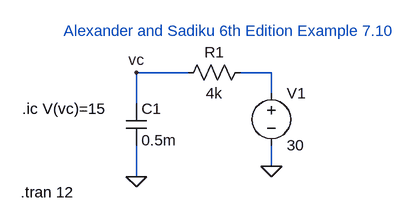
[diagram p0: schematic sadiku_chapter7_example_710_with_Source.asc]
sadiku_chapter7_example_710_with_Source.asc, the LTspice schematic file:
Version 4
SHEET 1 880 680
WIRE 96 80 16 80
WIRE 224 80 176 80
WIRE 224 112 224 80
WIRE 16 128 16 80
WIRE 224 224 224 192
WIRE 16 240 16 192
FLAG 16 240 0
FLAG 224 224 0
FLAG 16 80 vc
SYMBOL cap 0 128 R0
SYMATTR InstName C1
SYMATTR Value 0.5m
SYMBOL res 192 64 R90
WINDOW 0 0 56 VBottom 2
WINDOW 3 32 56 VTop 2
SYMATTR InstName R1
SYMATTR Value 4k
SYMBOL voltage 224 96 R0
WINDOW 123 0 0 Left 0
WINDOW 39 0 0 Left 0
SYMATTR InstName V1
SYMATTR Value 30
TEXT -160 136 Left 2 !.ic V(vc)=15
TEXT -96 16 Left 2 ;Alexander and Sadiku 6th Edition Example 7.10
TEXT -162 264 Left 2 !.tran 12

The netlist it stands for:
* sadiku_chapter7_example_710_with_Source.asc
C1 vc 0 0.5m
R1 N001 vc 4k
V1 N001 0 30
.ic V(vc)=15
* Alexander and Sadiku 6th Edition Example 7.10
.tran 12
.backanno
.end

* Results of the author's LTspice run, read from the files saved beside the schematic
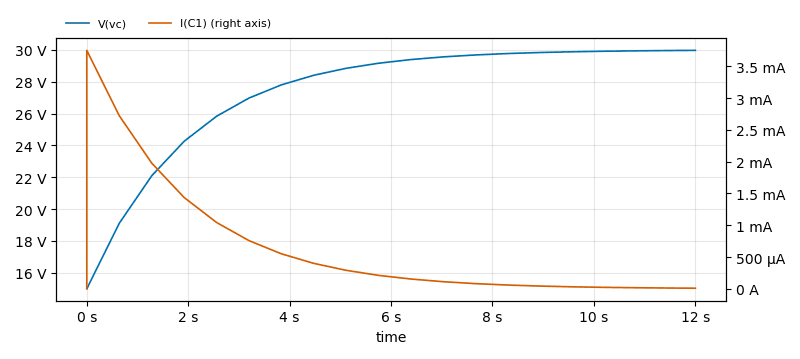
[diagram p1: Transient Analysis of sadiku_chapter7_example_710_with_Source.asc, plotted from the saved traces]
* Transient Analysis, 1 run:
*   V(vc): min 15 V, max 29.96 V, average 27.49 V, rms 27.72 V, last 29.96 V
*   I(C1): min 0 A, max 3.75 mA, average 628.7 µA, rms 1.101 mA, last 9.295 µA